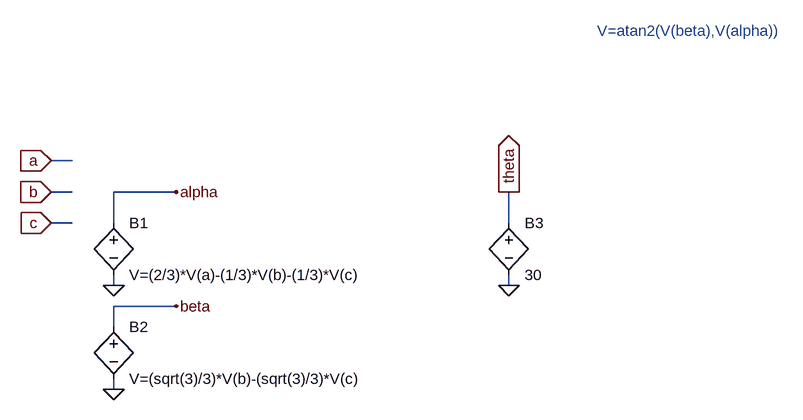
[diagram p0: schematic PLL.asc]
PLL.asc, the LTspice schematic file:
Version 4
SHEET 1 1240 680
WIRE 112 -112 80 -112
WIRE 112 -64 80 -64
WIRE 272 -64 176 -64
WIRE 112 -16 80 -16
WIRE 176 -16 176 -64
WIRE 784 -16 784 -64
WIRE 176 80 176 64
WIRE 784 80 784 64
WIRE 272 112 176 112
WIRE 176 144 176 112
WIRE 176 240 176 224
FLAG 80 -112 a
IOPIN 80 -112 In
FLAG 80 -64 b
IOPIN 80 -64 In
FLAG 80 -16 c
IOPIN 80 -16 In
FLAG 176 80 0
FLAG 176 240 0
FLAG 272 -64 alpha
FLAG 272 112 beta
FLAG 784 80 0
FLAG 784 -64 theta
IOPIN 784 -64 Out
SYMBOL bv 176 -32 R0
SYMATTR InstName B1
SYMATTR Value V=(2/3)*V(a)-(1/3)*V(b)-(1/3)*V(c)
SYMBOL bv 176 128 R0
SYMATTR InstName B2
SYMATTR Value V=(sqrt(3)/3)*V(b)-(sqrt(3)/3)*V(c)
SYMBOL bv 784 -32 R0
SYMATTR InstName B3
SYMATTR Value 30
TEXT 920 -312 Left 2 ;V=atan2(V(beta),V(alpha))

The netlist it stands for:
* PLL.asc
B1 alpha 0 V=(2/3)*V(a)-(1/3)*V(b)-(1/3)*V(c)
B2 beta 0 V=(sqrt(3)/3)*V(b)-(sqrt(3)/3)*V(c)
B3 theta 0 30
* V=atan2(V(beta),V(alpha))
.backanno
.end